# EAGLE design improved sample-and-hold-backup (EAGLE 7.2.0)
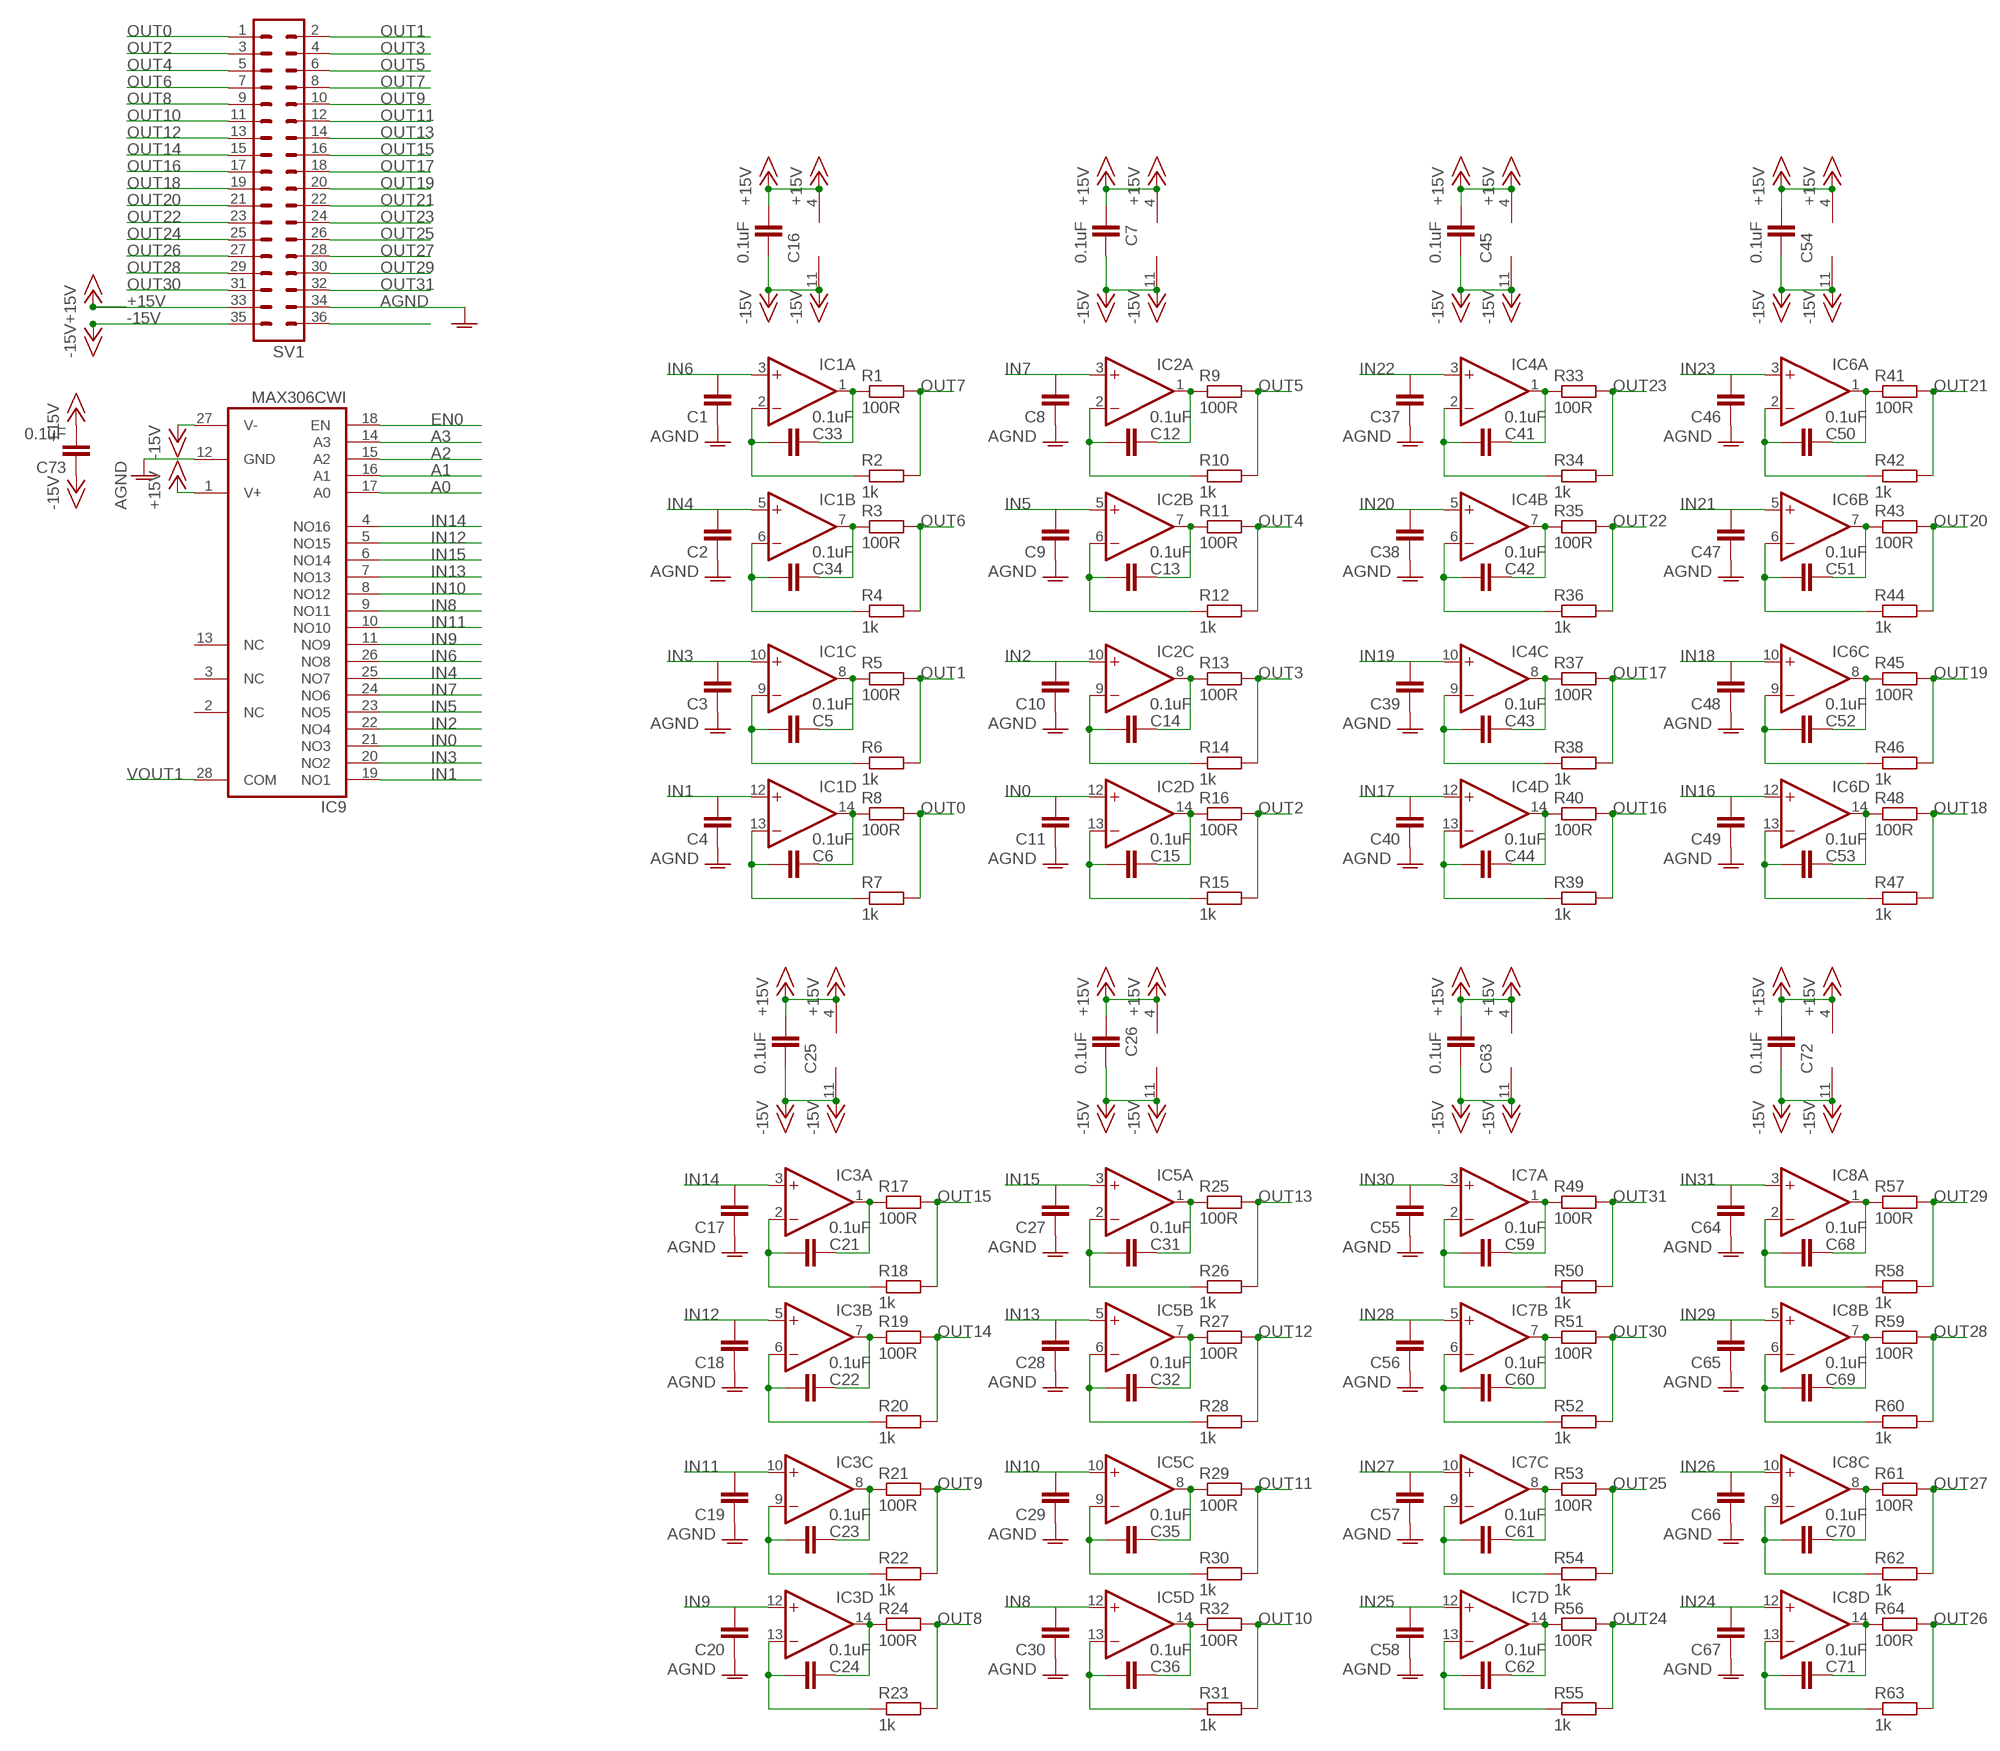
[diagram p0: schematic, sheet 1]

## Parts
C1  C-EUC1206  [C1206]
C2  C-EUC1206  [C1206]
C3  C-EUC1206  [C1206]
C4  C-EUC1206  [C1206]
C5  0.1uF  C-EUC0603  [C0603]
C6  0.1uF  C-EUC0603  [C0603]
C7  0.1uF  C-EUC0603  [C0603]
C8  C-EUC1206  [C1206]
C9  C-EUC1206  [C1206]
C10  C-EUC1206  [C1206]
C11  C-EUC1206  [C1206]
C12  0.1uF  C-EUC0603  [C0603]
C13  0.1uF  C-EUC0603  [C0603]
C14  0.1uF  C-EUC0603  [C0603]
C15  0.1uF  C-EUC0603  [C0603]
C16  0.1uF  C-EUC0603  [C0603]
C17  C-EUC1206  [C1206]
C18  C-EUC1206  [C1206]
C19  C-EUC1206  [C1206]
C20  C-EUC1206  [C1206]
C21  0.1uF  C-EUC0603  [C0603]
C22  0.1uF  C-EUC0603  [C0603]
C23  0.1uF  C-EUC0603  [C0603]
C24  0.1uF  C-EUC0603  [C0603]
C25  0.1uF  C-EUC0603  [C0603]
C26  0.1uF  C-EUC0603  [C0603]
C27  C-EUC1206  [C1206]
C28  C-EUC1206  [C1206]
C29  C-EUC1206  [C1206]
C30  C-EUC1206  [C1206]
C31  0.1uF  C-EUC0603  [C0603]
C32  0.1uF  C-EUC0603  [C0603]
C33  0.1uF  C-EUC0603  [C0603]
C34  0.1uF  C-EUC0603  [C0603]
C35  0.1uF  C-EUC0603  [C0603]
C36  0.1uF  C-EUC0603  [C0603]
C37  C-EUC1206  [C1206]
C38  C-EUC1206  [C1206]
C39  C-EUC1206  [C1206]
C40  C-EUC1206  [C1206]
C41  0.1uF  C-EUC0603  [C0603]
C42  0.1uF  C-EUC0603  [C0603]
C43  0.1uF  C-EUC0603  [C0603]
C44  0.1uF  C-EUC0603  [C0603]
C45  0.1uF  C-EUC0603  [C0603]
C46  C-EUC1206  [C1206]
C47  C-EUC1206  [C1206]
C48  C-EUC1206  [C1206]
C49  C-EUC1206  [C1206]
C50  0.1uF  C-EUC0603  [C0603]
C51  0.1uF  C-EUC0603  [C0603]
C52  0.1uF  C-EUC0603  [C0603]
C53  0.1uF  C-EUC0603  [C0603]
C54  0.1uF  C-EUC0603  [C0603]
C55  C-EUC1206  [C1206]
C56  C-EUC1206  [C1206]
C57  C-EUC1206  [C1206]
C58  C-EUC1206  [C1206]
C59  0.1uF  C-EUC0603  [C0603]
C60  0.1uF  C-EUC0603  [C0603]
C61  0.1uF  C-EUC0603  [C0603]
C62  0.1uF  C-EUC0603  [C0603]
C63  0.1uF  C-EUC0603  [C0603]
C64  C-EUC1206  [C1206]
C65  C-EUC1206  [C1206]
C66  C-EUC1206  [C1206]
C67  C-EUC1206  [C1206]
C68  0.1uF  C-EUC0603  [C0603]
C69  0.1uF  C-EUC0603  [C0603]
C70  0.1uF  C-EUC0603  [C0603]
C71  0.1uF  C-EUC0603  [C0603]
C72  0.1uF  C-EUC0603  [C0603]
C73  0.1uF  C-EUC0603  [C0603]
IC1  TL074D  [SO14]
IC2  TL074D  [SO14]
IC3  TL074D  [SO14]
IC4  TL074D  [SO14]
IC5  TL074D  [SO14]
IC6  TL074D  [SO14]
IC7  TL074D  [SO14]
IC8  TL074D  [SO14]
IC9  MAX306CWI  [SO28L]
R1  100R  R-EU_R0603  [R0603]
R2  1k  R-EU_R0603  [R0603]
R3  100R  R-EU_R0603  [R0603]
R4  1k  R-EU_R0603  [R0603]
R5  100R  R-EU_R0603  [R0603]
R6  1k  R-EU_R0603  [R0603]
R7  1k  R-EU_R0603  [R0603]
R8  100R  R-EU_R0603  [R0603]
R9  100R  R-EU_R0603  [R0603]
R10  1k  R-EU_R0603  [R0603]
R11  100R  R-EU_R0603  [R0603]
R12  1k  R-EU_R0603  [R0603]
R13  100R  R-EU_R0603  [R0603]
R14  1k  R-EU_R0603  [R0603]
R15  1k  R-EU_R0603  [R0603]
R16  100R  R-EU_R0603  [R0603]
R17  100R  R-EU_R0603  [R0603]
R18  1k  R-EU_R0603  [R0603]
R19  100R  R-EU_R0603  [R0603]
R20  1k  R-EU_R0603  [R0603]
R21  100R  R-EU_R0603  [R0603]
R22  1k  R-EU_R0603  [R0603]
R23  1k  R-EU_R0603  [R0603]
R24  100R  R-EU_R0603  [R0603]
R25  100R  R-EU_R0603  [R0603]
R26  1k  R-EU_R0603  [R0603]
R27  100R  R-EU_R0603  [R0603]
R28  1k  R-EU_R0603  [R0603]
R29  100R  R-EU_R0603  [R0603]
R30  1k  R-EU_R0603  [R0603]
R31  1k  R-EU_R0603  [R0603]
R32  100R  R-EU_R0603  [R0603]
R33  100R  R-EU_R0603  [R0603]
R34  1k  R-EU_R0603  [R0603]
R35  100R  R-EU_R0603  [R0603]
R36  1k  R-EU_R0603  [R0603]
R37  100R  R-EU_R0603  [R0603]
R38  1k  R-EU_R0603  [R0603]
R39  1k  R-EU_R0603  [R0603]
R40  100R  R-EU_R0603  [R0603]
R41  100R  R-EU_R0603  [R0603]
R42  1k  R-EU_R0603  [R0603]
R43  100R  R-EU_R0603  [R0603]
R44  1k  R-EU_R0603  [R0603]
R45  100R  R-EU_R0603  [R0603]
R46  1k  R-EU_R0603  [R0603]
R47  1k  R-EU_R0603  [R0603]
R48  100R  R-EU_R0603  [R0603]
R49  100R  R-EU_R0603  [R0603]
R50  1k  R-EU_R0603  [R0603]
R51  100R  R-EU_R0603  [R0603]
R52  1k  R-EU_R0603  [R0603]
R53  100R  R-EU_R0603  [R0603]
R54  1k  R-EU_R0603  [R0603]
R55  1k  R-EU_R0603  [R0603]
R56  100R  R-EU_R0603  [R0603]
R57  100R  R-EU_R0603  [R0603]
R58  1k  R-EU_R0603  [R0603]
R59  100R  R-EU_R0603  [R0603]
R60  1k  R-EU_R0603  [R0603]
R61  100R  R-EU_R0603  [R0603]
R62  1k  R-EU_R0603  [R0603]
R63  1k  R-EU_R0603  [R0603]
R64  100R  R-EU_R0603  [R0603]
SV1  MA18-2  [MA18-2]

## Nets
+15V: C7.1 C16.1 C25.1 C26.1 C45.1 C54.1 C63.1 C72.1 C73.2 IC1.4(P:V+) IC2.4(P:V+) IC3.4(P:V+) IC4.4(P:V+) IC5.4(P:V+) IC6.4(P:V+) IC7.4(P:V+) IC8.4(P:V+) IC9.1(V+) SV1.33
-15V: C7.2 C16.2 C25.2 C26.2 C45.2 C54.2 C63.2 C72.2 C73.1 IC1.11(P:V-) IC2.11(P:V-) IC3.11(P:V-) IC4.11(P:V-) IC5.11(P:V-) IC6.11(P:V-) IC7.11(P:V-) IC8.11(P:V-) IC9.27(V-) SV1.35
A0: IC9.17(A0)
A1: IC9.16(A1)
A2: IC9.15(A2)
A3: IC9.14(A3)
AGND: C1.1 C2.1 C3.1 C4.1 C8.1 C9.1 C10.1 C11.1 C17.1 C18.1 C19.1 C20.1 C27.1 C28.1 C29.1 C30.1 C37.1 C38.1 C39.1 C40.1 C46.1 C47.1 C48.1 C49.1 C55.1 C56.1 C57.1 C58.1 C64.1 C65.1 C66.1 C67.1 IC9.12(GND) SV1.34
EN0: IC9.18(EN)
IN0: C11.2 IC2.12(D:+IN) IC9.21(NO3)
IN1: C4.2 IC1.12(D:+IN) IC9.19(NO1)
IN2: C10.2 IC2.10(C:+IN) IC9.22(NO4)
IN3: C3.2 IC1.10(C:+IN) IC9.20(NO2)
IN4: C2.2 IC1.5(B:+IN) IC9.25(NO7)
IN5: C9.2 IC2.5(B:+IN) IC9.23(NO5)
IN6: C1.2 IC1.3(A:+IN) IC9.26(NO8)
IN7: C8.2 IC2.3(A:+IN) IC9.24(NO6)
IN8: C30.2 IC5.12(D:+IN) IC9.9(NO11)
IN9: C20.2 IC3.12(D:+IN) IC9.11(NO9)
IN10: C29.2 IC5.10(C:+IN) IC9.8(NO12)
IN11: C19.2 IC3.10(C:+IN) IC9.10(NO10)
IN12: C18.2 IC3.5(B:+IN) IC9.5(NO15)
IN13: C28.2 IC5.5(B:+IN) IC9.7(NO13)
IN14: C17.2 IC3.3(A:+IN) IC9.4(NO16)
IN15: C27.2 IC5.3(A:+IN) IC9.6(NO14)
IN16: C49.2 IC6.12(D:+IN)
IN17: C40.2 IC4.12(D:+IN)
IN18: C48.2 IC6.10(C:+IN)
IN19: C39.2 IC4.10(C:+IN)
IN20: C38.2 IC4.5(B:+IN)
IN21: C47.2 IC6.5(B:+IN)
IN22: C37.2 IC4.3(A:+IN)
IN23: C46.2 IC6.3(A:+IN)
IN24: C67.2 IC8.12(D:+IN)
IN25: C58.2 IC7.12(D:+IN)
IN26: C66.2 IC8.10(C:+IN)
IN27: C57.2 IC7.10(C:+IN)
IN28: C56.2 IC7.5(B:+IN)
IN29: C65.2 IC8.5(B:+IN)
IN30: C55.2 IC7.3(A:+IN)
IN31: C64.2 IC8.3(A:+IN)
N$1: C33.2 IC1.2(A:-IN) R2.1
N$2: C33.1 IC1.1(A:OUT) R1.1
N$3: C34.1 IC1.7(B:OUT) R3.1
N$4: C5.1 IC1.8(C:OUT) R5.1
N$5: C34.2 IC1.6(B:-IN) R4.1
N$6: C6.1 IC1.14(D:OUT) R8.1
N$7: C5.2 IC1.9(C:-IN) R6.1
N$8: C6.2 IC1.13(D:-IN) R7.1
N$9: C21.1 IC3.1(A:OUT) R17.1
N$10: C21.2 IC3.2(A:-IN) R18.1
N$11: C12.1 IC2.1(A:OUT) R9.1
N$12: C12.2 IC2.2(A:-IN) R10.1
N$13: C13.1 IC2.7(B:OUT) R11.1
N$14: C13.2 IC2.6(B:-IN) R12.1
N$15: C14.1 IC2.8(C:OUT) R13.1
N$16: C15.1 IC2.14(D:OUT) R16.1
N$17: C14.2 IC2.9(C:-IN) R14.1
N$18: C15.2 IC2.13(D:-IN) R15.1
N$19: C22.1 IC3.7(B:OUT) R19.1
N$20: C22.2 IC3.6(B:-IN) R20.1
N$21: C23.1 IC3.8(C:OUT) R21.1
N$22: C24.1 IC3.14(D:OUT) R24.1
N$23: C23.2 IC3.9(C:-IN) R22.1
N$24: C24.2 IC3.13(D:-IN) R23.1
N$25: C31.1 IC5.1(A:OUT) R25.1
N$26: C31.2 IC5.2(A:-IN) R26.1
N$27: C32.1 IC5.7(B:OUT) R27.1
N$28: C32.2 IC5.6(B:-IN) R28.1
N$29: C35.1 IC5.8(C:OUT) R29.1
N$30: C36.1 IC5.14(D:OUT) R32.1
N$31: C35.2 IC5.9(C:-IN) R30.1
N$32: C36.2 IC5.13(D:-IN) R31.1
N$33: C41.1 IC4.1(A:OUT) R33.1
N$34: C41.2 IC4.2(A:-IN) R34.1
N$35: C42.1 IC4.7(B:OUT) R35.1
N$36: C42.2 IC4.6(B:-IN) R36.1
N$37: C43.1 IC4.8(C:OUT) R37.1
N$38: C44.1 IC4.14(D:OUT) R40.1
N$39: C43.2 IC4.9(C:-IN) R38.1
N$40: C44.2 IC4.13(D:-IN) R39.1
N$41: C50.1 IC6.1(A:OUT) R41.1
N$42: C50.2 IC6.2(A:-IN) R42.1
N$43: C51.1 IC6.7(B:OUT) R43.1
N$44: C51.2 IC6.6(B:-IN) R44.1
N$45: C52.1 IC6.8(C:OUT) R45.1
N$46: C53.1 IC6.14(D:OUT) R48.1
N$47: C52.2 IC6.9(C:-IN) R46.1
N$48: C53.2 IC6.13(D:-IN) R47.1
N$49: C59.1 IC7.1(A:OUT) R49.1
N$50: C59.2 IC7.2(A:-IN) R50.1
N$51: C60.1 IC7.7(B:OUT) R51.1
N$52: C60.2 IC7.6(B:-IN) R52.1
N$53: C61.1 IC7.8(C:OUT) R53.1
N$54: C62.1 IC7.14(D:OUT) R56.1
N$55: C61.2 IC7.9(C:-IN) R54.1
N$56: C62.2 IC7.13(D:-IN) R55.1
N$57: C68.1 IC8.1(A:OUT) R57.1
N$58: C68.2 IC8.2(A:-IN) R58.1
N$59: C69.1 IC8.7(B:OUT) R59.1
N$60: C69.2 IC8.6(B:-IN) R60.1
N$61: C70.1 IC8.8(C:OUT) R61.1
N$62: C71.1 IC8.14(D:OUT) R64.1
N$63: C70.2 IC8.9(C:-IN) R62.1
N$64: C71.2 IC8.13(D:-IN) R63.1
N$65: SV1.36
OUT0: R7.2 R8.2 SV1.1
OUT1: R5.2 R6.2 SV1.2
OUT2: R15.2 R16.2 SV1.3
OUT3: R13.2 R14.2 SV1.4
OUT4: R11.2 R12.2 SV1.5
OUT5: R9.2 R10.2 SV1.6
OUT6: R3.2 R4.2 SV1.7
OUT7: R1.2 R2.2 SV1.8
OUT8: R23.2 R24.2 SV1.9
OUT9: R21.2 R22.2 SV1.10
OUT10: R31.2 R32.2 SV1.11
OUT11: R29.2 R30.2 SV1.12
OUT12: R27.2 R28.2 SV1.13
OUT13: R25.2 R26.2 SV1.14
OUT14: R19.2 R20.2 SV1.15
OUT15: R17.2 R18.2 SV1.16
OUT16: R39.2 R40.2 SV1.17
OUT17: R37.2 R38.2 SV1.18
OUT18: R47.2 R48.2 SV1.19
OUT19: R45.2 R46.2 SV1.20
OUT20: R43.2 R44.2 SV1.21
OUT21: R41.2 R42.2 SV1.22
OUT22: R35.2 R36.2 SV1.23
OUT23: R33.2 R34.2 SV1.24
OUT24: R55.2 R56.2 SV1.25
OUT25: R53.2 R54.2 SV1.26
OUT26: R63.2 R64.2 SV1.27
OUT27: R61.2 R62.2 SV1.28
OUT28: R59.2 R60.2 SV1.29
OUT29: R57.2 R58.2 SV1.30
OUT30: R51.2 R52.2 SV1.31
OUT31: R49.2 R50.2 SV1.32
VOUT1: IC9.28(COM)
Unconnected: IC9.2(NC) IC9.3(NC) IC9.13(NC)

## Library data of the parts
C1-C73 = resistor:C-EU: CAPACITOR, European symbol
IC1-IC8 = linear:TL074: OP AMP
IC9 = maxim:MAX306CWI: MULTIPLEXER; MF: MAXIM; MPN: MAX306CWI; OC_FARNELL: unknown; OC_NEWARK: 90C2555
R1-R64 = resistor:R-EU_: RESISTOR, European symbol
SV1 = con-lstb:MA18-2: PIN HEADER; OC_FARNELL: unknown; OC_NEWARK: unknown

## Board
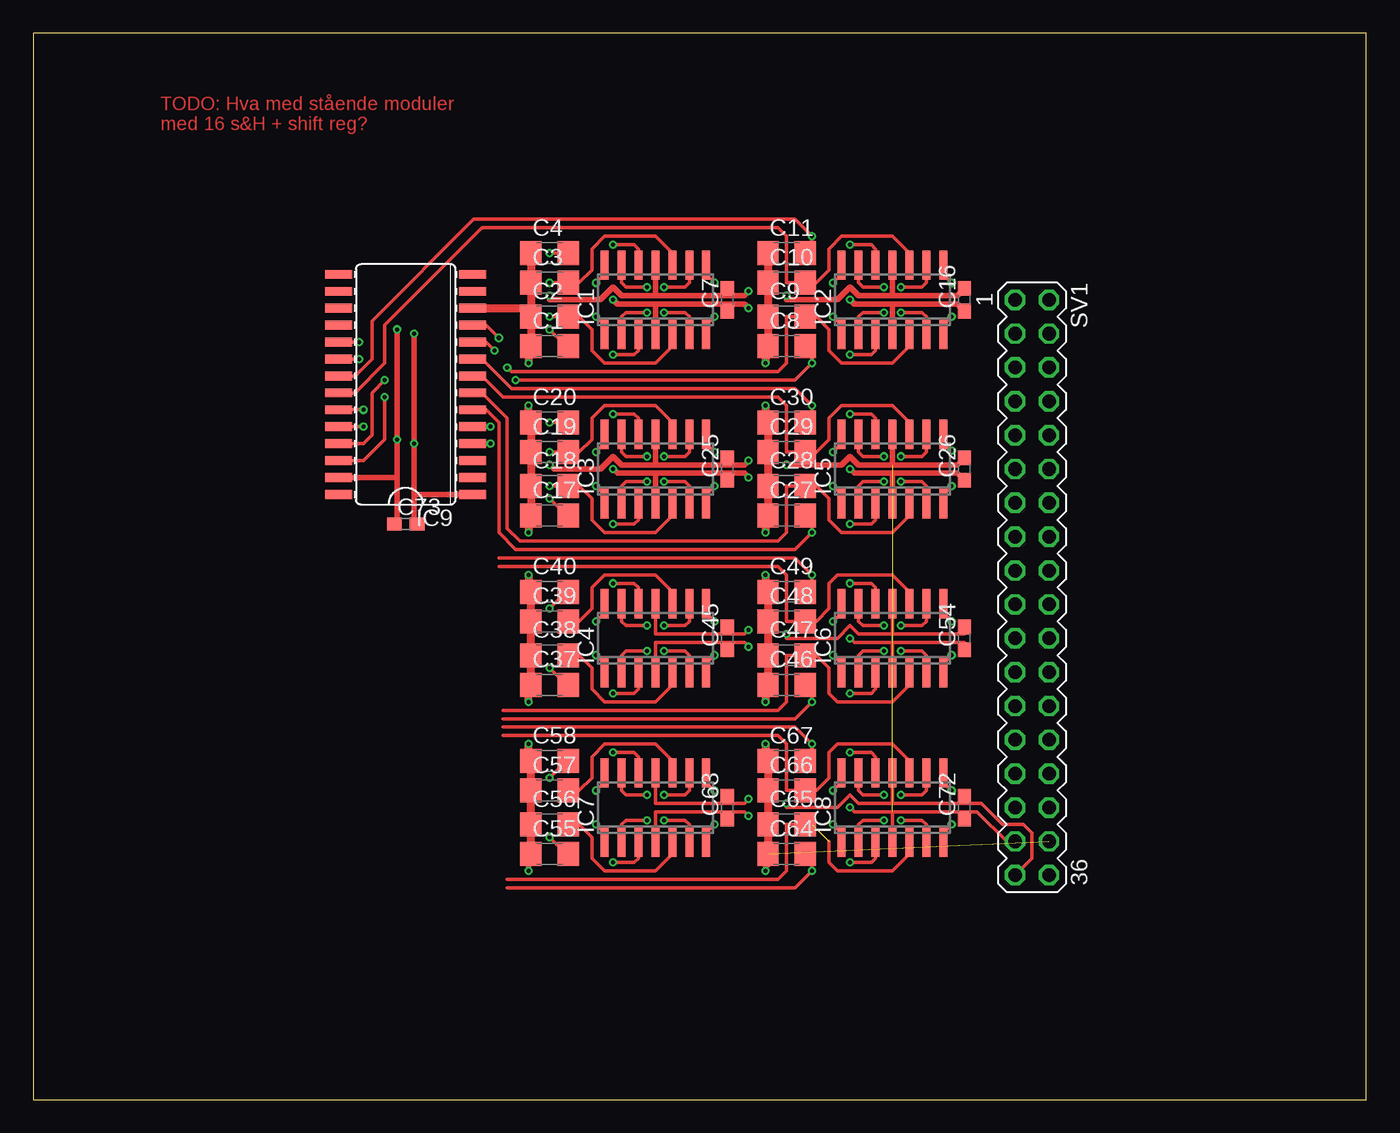
[diagram p1: board, top side]
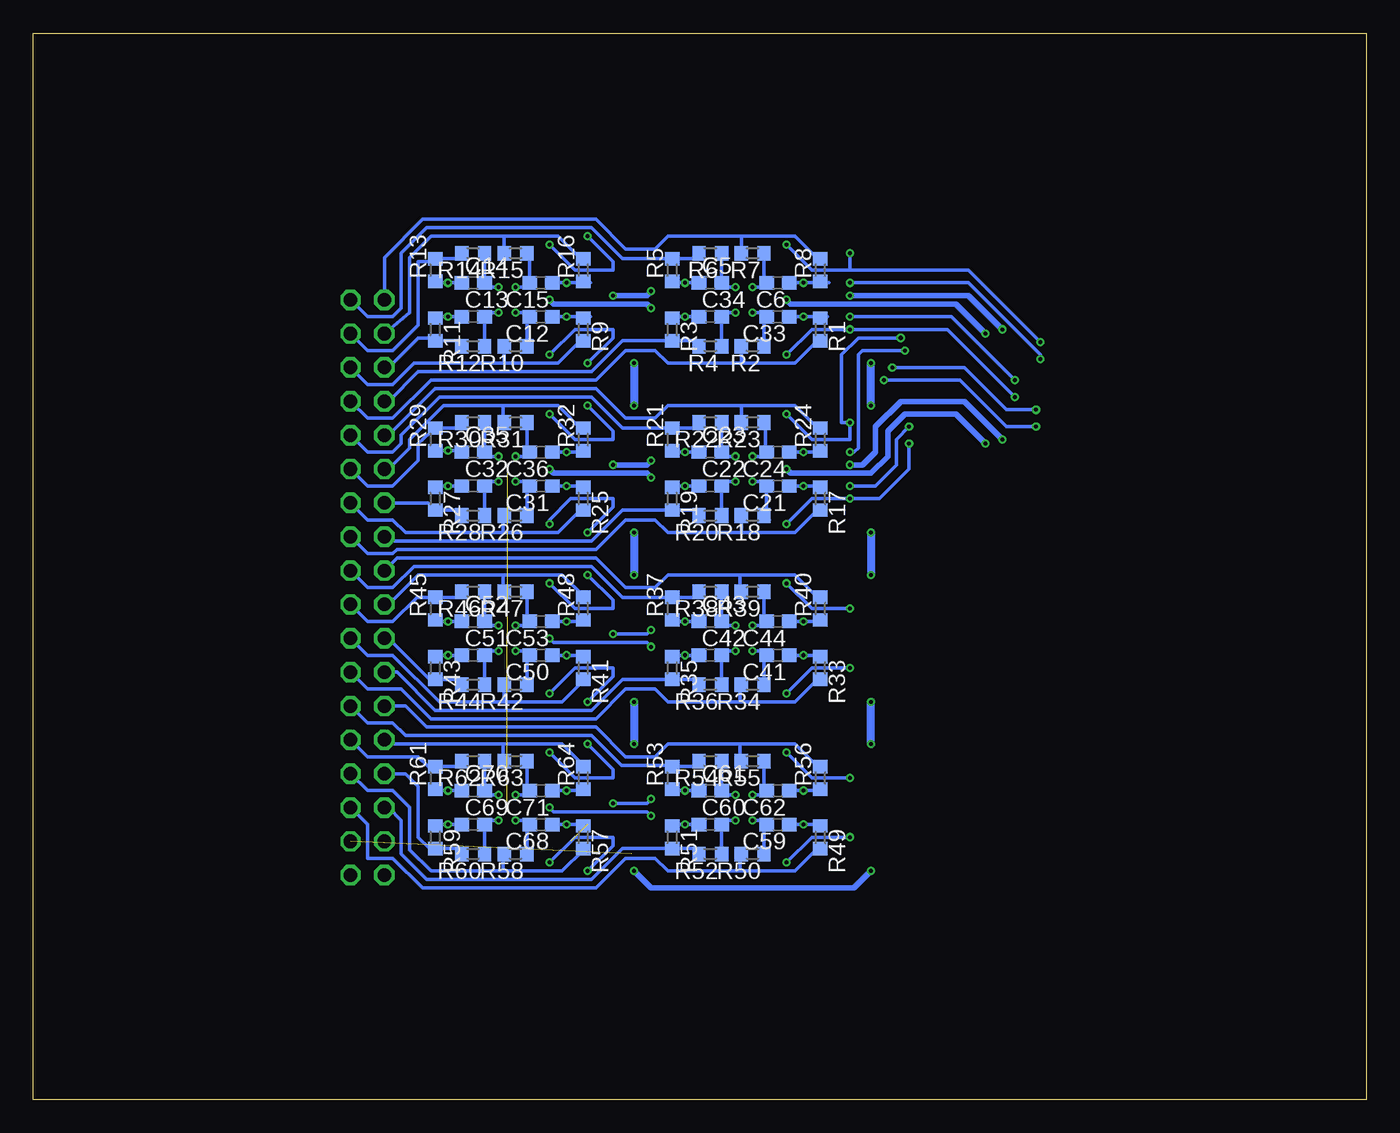
[diagram p2: board, bottom side, seen from below]

Size 100 x 80 mm. Coordinates in mm from the lower left corner, seen from the top.
Outline: 0,0 100,0 100,80 0,80 0,0
Copper layers (1*16): Top 0.035mm / dielectric 1.5mm / Bottom 0.035mm
Design rules "dirt_cheap_dirty_boards.v1": minimum track width 5mil, minimum drill 12mil, track to track 5mil, track to pad 5mil, pad to pad 5mil, via to via 5mil, smd to smd 0mil, copper to edge 10mil, drill to drill 10mil, minimum pad ring 10mil, minimum via ring 6mil, stop-mask expansion 2mil, vias tented up to drill 25mil, thermal gap 10mil

### Footprints (pad centres in the part's own frame; a part is rotated, then mirrored left to right if it is on the bottom)
C1206 = smd 1.6 x 1.8: 1 -1.4,0; 2 1.4,0
C0603 = smd 1.1 x 1: 1 -0.85,0; 2 0.85,0
SO14 = smd 0.6 x 2.2: 1 -3.81,-2.6; 2 -2.54,-2.6; 3 -1.27,-2.6; 4 0,-2.6; 5 1.27,-2.6; 6 2.54,-2.6; 7 3.81,-2.6; 8 3.81,2.6; 9 2.54,2.6; 10 1.27,2.6; 11 0,2.6; 12 -1.27,2.6; 13 -2.54,2.6; 14 -3.81,2.6
SO28L = smd 0.66 x 2.032: 1 -8.255,-5.029; 2 -6.985,-5.029; 3 -5.715,-5.029; 4 -4.445,-5.029; 5 -3.175,-5.029; 6 -1.905,-5.029; 7 -0.635,-5.029; 8 0.635,-5.029; 9 1.905,-5.029; 10 3.175,-5.029; 11 4.445,-5.029; 12 5.715,-5.029; 13 6.985,-5.029; 14 8.255,-5.029; 15 8.255,5.029; 16 6.985,5.029; 17 5.715,5.029; 18 4.445,5.029; 19 3.175,5.029; 20 1.905,5.029; 21 0.635,5.029; 22 -0.635,5.029; 23 -1.905,5.029; 24 -3.175,5.029; 25 -4.445,5.029; 26 -5.715,5.029; 27 -6.985,5.029; 28 -8.255,5.029
R0603 = smd 1 x 1.1: 1 -0.85,0; 2 0.85,0
MA18-2 = drill 1.016 octagon: 1 -21.59,-1.27; 2 -21.59,1.27; 3 -19.05,-1.27; 4 -19.05,1.27; 5 -16.51,-1.27; 6 -16.51,1.27; 7 -13.97,-1.27; 8 -13.97,1.27; 9 -11.43,-1.27; 10 -11.43,1.27; 11 -8.89,-1.27; 12 -8.89,1.27; 13 -6.35,-1.27; 14 -6.35,1.27; 15 -3.81,-1.27; 16 -3.81,1.27; 17 -1.27,-1.27; 18 -1.27,1.27; 19 1.27,-1.27; 20 1.27,1.27; 21 3.81,-1.27; 22 3.81,1.27; 23 6.35,-1.27; 24 6.35,1.27; 25 8.89,-1.27; 26 8.89,1.27; 27 11.43,-1.27; 28 11.43,1.27; 29 13.97,-1.27; 30 13.97,1.27; 31 16.51,-1.27; 32 16.51,1.27; 33 19.05,-1.27; 34 19.05,1.27; 35 21.59,-1.27; 36 21.59,1.27

### Placement (x,y rotation side)
C1  38.73,56.52 0 top
C2  38.73,58.74 0 top
C3  38.73,61.28 0 top
C4  38.73,63.5 0 top
C5  49.21,61.28 0 bottom
C6  44.13,61.28 180 bottom
C7  52.07,60.01 90 top
C8  56.52,56.52 0 top
C9  56.52,58.74 0 top
C10  56.52,61.28 0 top
C11  56.52,63.5 0 top
C12  61.91,58.74 180 bottom
C13  66.99,58.74 0 bottom
C14  66.99,61.28 0 bottom
C15  61.91,61.28 180 bottom
C16  69.85,60.01 90 top
C17  38.73,43.81 0 top
C18  38.73,46.04 0 top
C19  38.73,48.58 0 top
C20  38.73,50.8 0 top
C21  44.13,46.04 180 bottom
C22  49.21,46.04 0 bottom
C23  49.21,48.58 0 bottom
C24  44.13,48.58 180 bottom
C25  52.07,47.31 90 top
C26  69.85,47.31 90 top
C27  56.52,43.81 0 top
C28  56.52,46.04 0 top
C29  56.52,48.58 0 top
C30  56.52,50.8 0 top
C31  61.91,46.04 180 bottom
C32  66.99,46.04 0 bottom
C33  44.13,58.74 180 bottom
C34  49.21,58.74 0 bottom
C35  66.99,48.58 0 bottom
C36  61.91,48.58 180 bottom
C37  38.73,31.11 0 top
C38  38.73,33.34 0 top
C39  38.73,35.88 0 top
C40  38.73,38.1 0 top
C41  44.13,33.34 180 bottom
C42  49.21,33.34 0 bottom
C43  49.21,35.88 0 bottom
C44  44.13,35.88 180 bottom
C45  52.07,34.61 90 top
C46  56.52,31.11 0 top
C47  56.52,33.34 0 top
C48  56.52,35.88 0 top
C49  56.52,38.1 0 top
C50  61.91,33.34 180 bottom
C51  66.99,33.34 0 bottom
C52  66.99,35.88 0 bottom
C53  61.91,35.88 180 bottom
C54  69.85,34.61 90 top
C55  38.73,18.41 0 top
C56  38.73,20.64 0 top
C57  38.73,23.18 0 top
C58  38.73,25.4 0 top
C59  44.13,20.64 180 bottom
C60  49.21,20.64 0 bottom
C61  49.21,23.18 0 bottom
C62  44.13,23.18 180 bottom
C63  52.07,21.91 90 top
C64  56.52,18.41 0 top
C65  56.52,20.64 0 top
C66  56.52,23.18 0 top
C67  56.52,25.4 0 top
C68  61.91,20.64 180 bottom
C69  66.99,20.64 0 bottom
C70  66.99,23.18 0 bottom
C71  61.91,23.18 180 bottom
C72  69.85,21.91 90 top
C73  27.94,43.18 0 top
IC1  46.67,60.01 0 top
IC2  64.45,60.01 0 top
IC3  46.67,47.31 0 top
IC4  46.67,34.61 0 top
IC5  64.45,47.31 0 top
IC6  64.45,34.61 0 top
IC7  46.67,21.91 0 top
IC8  64.45,21.91 0 top
IC9  27.94,53.66 90 top
R1  40.96,57.78 270 bottom
R2  46.04,56.52 180 bottom
R3  52.07,57.78 270 bottom
R4  49.21,56.52 180 bottom
R5  52.07,62.23 90 bottom
R6  49.21,63.5 180 bottom
R7  46.04,63.5 180 bottom
R8  40.96,62.23 90 bottom
R9  58.74,57.78 270 bottom
R10  63.82,56.52 180 bottom
R11  69.85,57.78 270 bottom
R12  66.99,56.52 180 bottom
R13  69.85,62.23 90 bottom
R14  66.99,63.5 180 bottom
R15  63.82,63.5 180 bottom
R16  58.74,62.23 90 bottom
R17  40.96,45.09 270 bottom
R18  46.04,43.81 180 bottom
R19  52.07,45.09 270 bottom
R20  49.21,43.81 180 bottom
R21  52.07,49.53 90 bottom
R22  49.21,50.8 180 bottom
R23  46.04,50.8 180 bottom
R24  40.96,49.53 90 bottom
R25  58.74,45.09 270 bottom
R26  63.82,43.81 180 bottom
R27  69.85,45.09 270 bottom
R28  66.99,43.81 180 bottom
R29  69.85,49.53 90 bottom
R30  66.99,50.8 180 bottom
R31  63.82,50.8 180 bottom
R32  58.74,49.53 90 bottom
R33  40.96,32.38 270 bottom
R34  46.04,31.11 180 bottom
R35  52.07,32.38 270 bottom
R36  49.21,31.11 180 bottom
R37  52.07,36.83 90 bottom
R38  49.21,38.1 180 bottom
R39  46.04,38.1 180 bottom
R40  40.96,36.83 90 bottom
R41  58.74,32.38 270 bottom
R42  63.82,31.11 180 bottom
R43  69.85,32.38 270 bottom
R44  66.99,31.11 180 bottom
R45  69.85,36.83 90 bottom
R46  66.99,38.1 180 bottom
R47  63.82,38.1 180 bottom
R48  58.74,36.83 90 bottom
R49  40.96,19.68 270 bottom
R50  46.04,18.41 180 bottom
R51  52.07,19.68 270 bottom
R52  49.21,18.41 180 bottom
R53  52.07,24.13 90 bottom
R54  49.21,25.4 180 bottom
R55  46.04,25.4 180 bottom
R56  40.96,24.13 90 bottom
R57  58.74,19.68 270 bottom
R58  63.82,18.41 180 bottom
R59  69.85,19.68 270 bottom
R60  66.99,18.41 180 bottom
R61  69.85,24.13 90 bottom
R62  66.99,25.4 180 bottom
R63  63.82,25.4 180 bottom
R64  58.74,24.13 90 bottom
SV1  74.93,38.42 270 top

### Tracks (layer width: path | path; a pad name or v marks a point on that pad's centre or on a via)
+15V  (via drill 0.3)  (2 unrouted)
  Top 0.254: IC4.4 46.67,34.29 52.07,34.29 | 52.07,34.29 C45.1 | C54.1 69.85,34.29 64.45,34.29 | 64.45,34.29 61.59,34.29 v61.28,34.61 | v53.66,33.97 53.34,34.29 52.07,34.29 | IC6.4 64.45,34.29 | IC7.4 46.67,21.59 52.07,21.59 | 52.07,21.59 C63.1 | 69.85,21.59 64.45,21.59 | 64.45,21.59 61.59,21.59 v61.28,21.91 | v53.66,21.27 53.34,21.59 52.07,21.59 | IC8.4 64.45,21.59 | C72.1 69.85,21.59 | 69.85,21.59 70.8,21.59 73.03,19.37 SV1.33
  Top 0.406: 28.57,45.4 v28.57,49.21 v28.57,57.47 | 28.57,45.4 28.57,43.4 C73.2 | IC9.1 28.57,45.4 | IC3.4 46.67,46.99 | v43.5,47.31 43.81,46.99 46.67,46.99 | 46.67,46.99 52.07,46.99 | v53.66,59.37 53.34,59.69 52.07,59.69 | C7.1 52.07,59.69 | 52.07,59.69 46.67,59.69 | 46.67,59.69 43.81,59.69 v43.5,60.01 | IC1.4 46.67,59.69 | v61.28,60.01 61.59,59.69 64.45,59.69 | 64.45,59.69 69.32,59.69 C16.1 | IC2.4 64.45,59.69 | C25.1 52.07,46.99 | 52.07,46.99 53.34,46.99 v53.66,46.67 | v61.28,47.31 61.59,46.99 64.45,46.99 | 64.45,46.99 69.32,46.99 C26.1 | 64.45,46.99 IC5.4
  Bottom 0.254: v61.28,34.61 60.96,34.29 53.98,34.29 v53.66,33.97 | v61.28,21.91 60.96,21.59 53.98,21.59 v53.66,21.27
  Bottom 0.406: v43.5,47.31 43.18,46.99 37.15,46.99 35.88,48.26 35.88,50.16 34.61,51.44 30.8,51.44 v28.57,49.21 | v43.5,60.01 43.18,59.69 30.8,59.69 v28.57,57.47 | v53.66,59.37 53.98,59.69 60.96,59.69 v61.28,60.01 | v53.66,46.67 53.98,46.99 60.96,46.99 v61.28,47.31
-15V  (via drill 0.3)  (2 unrouted)
  Top 0.254: C25.2 52.07,47.62 52.39,47.62 | IC4.11 46.67,34.92 52.07,34.92 | 52.07,34.92 C45.2 | C54.2 69.85,34.92 64.45,34.92 | IC6.11 64.45,34.92 | 64.45,34.92 61.91,34.92 61.28,35.56 60.33,34.61 56.52,34.61 v56.52,34.92 | v53.66,35.24 53.34,34.92 52.07,34.92 | IC7.11 46.67,22.23 52.07,22.23 | 52.07,22.23 C63.2 | C72.2 69.85,22.23 | 69.85,22.23 64.45,22.23 | 64.45,22.23 61.91,22.23 61.28,22.86 60.33,21.91 56.52,21.91 v56.52,22.23 | v53.66,22.54 53.34,22.23 52.07,22.23 | IC8.11 64.45,22.23 | 69.85,22.23 71.12,22.23 72.71,20.64 74.3,20.64 74.93,20 74.93,18.1 SV1.35
  Top 0.406: 26.99,43.18 27.3,43.18 27.3,46.67 | 27.3,46.67 IC9.27 | 27.3,46.67 v27.3,49.53 v27.3,57.78 | v38.73,47.62 39.05,47.31 42.55,47.31 43.5,48.26 44.13,47.62 46.67,47.62 | 46.67,47.62 52.39,47.62 53.34,47.62 v53.66,47.94 | IC3.11 46.67,47.62 | v53.66,60.64 53.34,60.33 52.07,60.33 | C7.2 52.07,60.33 | 52.07,60.33 46.67,60.33 | 46.67,60.33 44.13,60.33 43.5,60.96 42.55,60.01 38.73,60.01 v38.73,60.33 | IC1.11 46.67,60.33 | v56.52,60.33 56.52,60.01 60.33,60.01 61.28,60.96 61.91,60.33 64.45,60.33 | 64.45,60.33 69.32,60.33 C16.2 | IC2.11 64.45,60.33 | v56.52,47.62 60.64,47.62 61.28,48.26 61.91,47.62 64.45,47.62 | 64.45,47.62 69.32,47.62 C26.2 | IC5.11 64.45,47.62
  Top 0.61: 26.99,43.18 C73.1
  Bottom 0.254: v56.52,34.92 53.98,34.92 v53.66,35.24 | v56.52,22.23 53.98,22.23 v53.66,22.54
  Bottom 0.406: v27.3,49.53 30.16,52.39 34.92,52.39 36.83,50.48 36.83,48.58 37.78,47.62 v38.73,47.62 | v38.73,60.33 29.84,60.33 v27.3,57.78 | v53.66,60.64 53.98,60.33 v56.52,60.33 | v53.66,47.94 53.98,47.62 v56.52,47.62
AGND  (via drill 0.3)  (1 unrouted)
  Top 0.254: 37.34,59.37 C2.1 | C10.1 55.24,61.28 | C27.1 55.24,43.69 | C20.1 37.34,51.44 37.15,51.44 | 37.15,56.52 C1.1
  Top 0.406: C64.1 55.12,17.65 54.93,17.46 v54.93,17.14 | v37.15,17.14 37.15,18.23 C55.1
  Top 0.61: IC9.12 37.34,59.37 | C4.1 C3.1 C2.1 C1.1 | C20.1 C19.1 C18.1 C17.1 37.34,43.69 37.15,43.5 v37.15,42.55 | 37.15,56.52 v37.15,55.24 | 37.15,51.44 v37.15,52.07 | v37.15,39.37 37.15,38.29 C40.1 C39.1 C38.1 C37.1 37.15,30.93 v37.15,29.84 | C55.1 C56.1 C57.1 C58.1 37.34,25.53 37.15,25.72 v37.15,26.67 | C11.1 C10.1 C9.1 C8.1 55.12,56.07 54.93,55.88 v54.93,55.24 | v54.93,52.07 54.93,50.99 C30.1 C29.1 C28.1 C27.1 | 55.24,43.69 55.24,43.5 54.93,43.18 v54.93,42.55 | v54.93,39.37 54.93,38.29 C49.1 C48.1 C47.1 C46.1 55.12,30.98 54.93,30.8 v54.93,29.84 | v54.93,26.67 54.93,25.59 C67.1 C66.1 C65.1 C64.1
  Bottom 0.406: v54.93,17.14 53.66,15.88 38.42,15.88 v37.15,17.14
  Bottom 0.61: v37.15,52.07 v37.15,55.24 | v37.15,42.55 v37.15,39.37 | v37.15,26.67 v37.15,29.84 | v54.93,42.55 v54.93,39.37 | v54.93,29.84 v54.93,26.67 | v54.93,55.24 v54.93,52.07
IN0  (via drill 0.3)
  Top 0.254: IC2.12 63.18,63.82 62.87,64.14 v61.28,64.14 | C11.2 58.42,63.5 v58.42,64.77 57.15,66.04 33.02,66.04 25.4,58.42 25.4,55.56 24.13,54.29 IC9.21
  Bottom 0.254: v61.28,64.14 59.37,62.23 56.52,62.23 56.52,62.87 v58.42,64.77
IN1  (via drill 0.3)
  Top 0.254: C4.2 v38.73,63.5 | IC1.12 45.4,63.82 45.09,64.14 v43.5,64.14 | IC9.19 v24.45,56.83
  Bottom 0.254: 38.73,62.23 29.84,62.23 v24.45,56.83 | v43.5,64.14 41.59,62.23 38.73,62.23 | 38.73,62.23 v38.73,63.5
IN2
  Top 0.254: IC2.10 65.72,63.5 64.45,64.77 60.64,64.77 59.69,63.82 59.69,62.23 58.74,61.28 C10.2 57.91,61.41 57.78,61.28 56.52,61.28 56.52,64.77 55.88,65.41 33.66,65.41 26.35,58.1 26.35,55.24 24.13,53.02 IC9.22
IN3  (via drill 0.3)
  Top 0.254: v38.73,61.28 C3.2 40.96,61.28 41.91,62.23 41.91,63.82 42.86,64.77 46.67,64.77 47.94,63.5 IC1.10 | IC9.20 v24.45,55.56
  Bottom 0.254: v38.73,61.28 29.84,61.28 24.45,55.88 v24.45,55.56
IN4  (via drill 0.3)
  Top 0.254: v38.73,58.74 C2.2 40.13,58.61 40.01,58.74 40.96,58.74 41.91,57.78 41.91,56.2 42.86,55.24 46.67,55.24 47.94,56.52 IC1.5 | v26.35,53.98 25.4,53.02 25.4,49.85 24.77,49.21 IC9.25
  Bottom 0.254: v38.73,58.74 31.11,58.74 v26.35,53.98
IN5  (via drill 0.3)
  Top 0.254: IC2.5 65.72,56.52 64.45,55.24 60.64,55.24 59.69,56.2 59.69,57.78 58.74,58.74 C9.2 57.91,58.61 57.78,58.74 56.52,58.74 56.52,55.24 55.88,54.61 35.88,54.61 v35.56,54.93 | v24.77,51.75 IC9.23
  Bottom 0.254: v35.56,54.93 30.16,54.93 26.99,51.75 v24.77,51.75
IN6  (via drill 0.3)
  Top 0.254: C1.2 40.01,56.52 v38.73,57.78 | v43.5,55.88 45.09,55.88 45.4,56.2 IC1.3 | v26.35,52.7 26.35,49.53 24.77,47.94 IC9.26
  Bottom 0.254: v43.5,55.88 41.59,57.78 v38.73,57.78 31.43,57.78 v26.35,52.7
IN7  (via drill 0.3)
  Top 0.254: IC2.3 63.18,56.2 62.87,55.88 v61.28,55.88 | C8.2 57.78,56.2 58.42,55.88 v58.42,55.24 57.15,53.98 v36.2,53.98 | v24.77,50.48 IC9.24
  Bottom 0.254: v61.28,55.88 59.37,57.78 56.52,57.78 56.52,57.15 v58.42,55.24 | v36.2,53.98 30.48,53.98 26.99,50.48 v24.77,50.48
IN8  (via drill 0.3)
  Top 0.254: IC5.12 63.18,51.12 62.87,51.44 v61.28,51.44 | 57.78,50.93 C30.2 58.1,50.8 58.42,51.12 v58.42,52.07 57.15,53.34 35.88,53.34 33.66,55.56 IC9.9
  Bottom 0.254: v61.28,51.44 59.37,49.53 56.52,49.53 56.52,50.16 v58.42,52.07
IN9  (via drill 0.3)
  Top 0.254: C20.2 v38.73,50.8 | v43.5,51.44 45.09,51.44 45.4,51.12 IC3.12 | IC9.11 33.97,58.1 v34.92,57.15
  Bottom 0.254: v43.5,51.44 41.59,49.53 38.73,49.53 v38.73,50.8 39.37,50.8 39.37,55.88 38.1,57.15 v34.92,57.15
IN10
  Top 0.254: IC5.10 65.72,50.8 64.45,52.07 60.64,52.07 59.69,51.12 59.69,49.53 58.74,48.58 C29.2 56.52,48.58 56.52,52.07 55.88,52.7 35.24,52.7 33.66,54.29 IC9.8
IN11  (via drill 0.3)
  Top 0.254: IC3.10 47.94,50.8 46.67,52.07 42.86,52.07 41.91,51.12 41.91,49.53 40.96,48.58 C19.2 v38.73,48.58 | IC9.10 33.97,56.83 v34.61,56.2
  Bottom 0.254: v34.61,56.2 37.78,56.2 38.1,55.88 38.1,48.9 38.42,48.58 v38.73,48.58
IN12  (via drill 0.3)
  Top 0.254: IC3.5 47.94,43.81 46.67,42.55 42.86,42.55 41.91,43.5 41.91,45.09 40.96,46.04 C18.2 v38.73,46.04 | IC9.5 v34.29,50.48
  Bottom 0.254: v34.29,50.48 35.24,49.53 35.24,47.62 36.83,46.04 v38.73,46.04
IN13
  Top 0.254: IC5.5 65.72,43.81 64.45,42.55 60.64,42.55 59.69,43.5 59.69,45.09 58.74,46.04 C28.2 56.52,46.04 56.52,42.55 55.88,41.91 36.51,41.91 35.56,42.86 35.56,51.12 33.66,53.02 IC9.7
IN14  (via drill 0.3)
  Top 0.254: C17.2 40.01,43.81 v38.73,45.09 | v43.5,43.18 45.09,43.18 45.4,43.5 IC3.3 | IC9.4 v34.29,49.21
  Bottom 0.254: v43.5,43.18 41.59,45.09 v38.73,45.09 38.42,45.09 36.51,45.09 34.29,47.31 v34.29,49.21
IN15  (via drill 0.3)
  Top 0.254: IC5.3 63.18,43.5 62.87,43.18 v61.28,43.18 | 57.78,43.69 C27.2 58.42,43.31 v58.42,42.55 57.15,41.27 36.2,41.27 34.92,42.55 34.92,50.8 33.97,51.75 IC9.6
  Bottom 0.254: v61.28,43.18 61.28,43.5 59.69,45.09 56.52,45.09 56.52,44.45 v58.42,42.55
IN16  (via drill 0.3)
  Top 0.254: IC6.12 63.18,38.42 62.87,38.73 v61.28,38.73 | 57.78,38.23 C49.2 57.91,38.23 58.42,38.73 v58.42,39.37 57.15,40.64 34.92,40.64
  Bottom 0.254: v61.28,38.73 59.37,36.83 56.52,36.83 56.52,37.47 v58.42,39.37
IN17  (via drill 0.3)
  Top 0.254: IC4.12 45.4,38.42 45.09,38.73 v43.5,38.73 | v38.73,36.83 39.37,37.47 39.5,37.47 C40.2
  Bottom 0.254: v43.5,38.73 41.59,36.83 v38.73,36.83
IN18
  Top 0.254: IC6.10 65.72,38.1 64.45,39.37 60.33,39.37 59.69,38.73 59.69,36.83 58.74,35.88 C48.2 56.52,35.88 56.52,39.37 55.88,40.01 34.92,40.01
IN19
  Top 0.254: C39.2 40.96,35.88 41.91,36.83 41.91,38.42 42.86,39.37 46.67,39.37 47.94,38.1 IC4.10
IN20
  Top 0.254: C38.2 40.96,33.34 41.91,32.38 41.91,30.8 42.86,29.84 46.67,29.84 47.94,31.11 IC4.5
IN21
  Top 0.254: IC6.5 65.72,31.11 64.45,29.84 60.33,29.84 59.69,30.48 59.69,32.38 58.74,33.34 C47.2 56.52,33.34 56.52,29.84 55.88,29.21 35.24,29.21
IN22  (via drill 0.3)
  Top 0.254: IC4.3 45.4,30.8 45.09,30.48 v43.5,30.48 | v38.73,32.38 39.37,31.75 39.5,31.75 C37.2
  Bottom 0.254: v43.5,30.48 41.59,32.38 v38.73,32.38
IN23  (via drill 0.3)
  Top 0.254: IC6.3 63.18,30.8 62.87,30.48 v61.28,30.48 | 57.78,30.98 C46.2 58.42,31.11 v58.42,29.84 57.15,28.57 35.24,28.57
  Bottom 0.254: v61.28,30.48 59.37,32.38 56.52,32.38 56.52,31.75 v58.42,29.84
IN24  (via drill 0.3)
  Top 0.254: IC8.12 63.18,25.72 62.87,26.04 v61.28,26.04 | 57.78,25.53 C67.2 58.42,25.4 v58.42,26.67 57.15,27.94 35.24,27.94
  Bottom 0.254: v61.28,26.04 59.37,24.13 56.52,24.13 56.52,24.77 v58.42,26.67
IN25  (via drill 0.3)
  Top 0.254: IC7.12 45.4,25.72 45.09,26.04 v43.5,26.04 | v38.73,24.13 39.37,24.77 39.5,24.77 C58.2
  Bottom 0.254: v43.5,26.04 41.59,24.13 v38.73,24.13
IN26
  Top 0.254: IC8.10 65.72,25.4 64.45,26.67 60.33,26.67 59.69,26.04 59.69,24.13 58.74,23.18 C66.2 56.52,23.18 56.52,26.67 55.88,27.3 35.24,27.3
IN27
  Top 0.254: C57.2 40.96,23.18 41.91,24.13 41.91,25.72 42.86,26.67 46.67,26.67 47.94,25.4 IC7.10
IN28
  Top 0.254: C56.2 40.96,20.64 41.91,19.68 41.91,18.1 42.86,17.14 46.67,17.14 47.94,18.41 IC7.5
IN29  (1 unrouted)
  Top 0.254: 58.42,20.64 C65.2 56.52,20.64 56.52,17.14 55.88,16.51 35.56,16.51 | 59.69,19.37 59.69,17.78 60.33,17.14 64.45,17.14 65.72,18.41 IC8.5
IN30  (via drill 0.3)
  Top 0.254: C55.2 40.01,18.41 v38.73,19.68 | v43.5,17.78 45.09,17.78 45.4,18.1 IC7.3
  Bottom 0.254: v38.73,19.68 41.59,19.68 v43.5,17.78
IN31  (via drill 0.3)
  Top 0.254: IC8.3 63.18,18.1 62.87,17.78 v61.28,17.78 | 57.78,18.29 C64.2 58.42,18.41 v58.42,17.14 57.15,15.88 35.56,15.88
  Bottom 0.254: v61.28,17.78 59.37,19.68 56.52,19.68 56.52,19.05 v58.42,17.14
N$1  (via drill 0.3)
  Top 0.254: IC1.2 44.13,58.74 44.45,59.05 v46.04,59.05
  Bottom 0.254: v46.04,59.05 45.09,59.05 44.98,58.95 C33.2 45.19,58.53 R2.1
N$2  (via drill 0.3)
  Top 0.254: IC1.1 42.86,58.1 v42.23,58.74
  Bottom 0.254: C33.1 v42.23,58.74 40.42,58.74 R1.1
N$3  (via drill 0.3)
  Top 0.254: IC1.7 50.48,58.1 v51.12,58.74
  Bottom 0.254: R3.1 51.97,58.74 v51.12,58.74 C34.1
N$4  (via drill 0.3)
  Top 0.254: IC1.8 50.48,61.91 v51.12,61.28
  Bottom 0.254: 52.49,61.38 R5.1 52.28,61.28 v51.12,61.28 C5.1
N$5  (via drill 0.3)
  Top 0.254: IC1.6 49.21,58.74 48.9,59.05 v47.31,59.05
  Bottom 0.254: R4.1 C34.2 48.05,59.05 v47.31,59.05
N$6  (via drill 0.3)
  Top 0.254: v42.23,61.28 42.86,61.91 IC1.14
  Bottom 0.254: C6.1 v42.23,61.28 40.32,61.28 R8.1
N$7  (via drill 0.3)
  Top 0.254: IC1.9 49.21,61.28 48.9,60.96 v47.31,60.96
  Bottom 0.254: R6.1 C5.2 48.68,60.96 v47.31,60.96
N$8  (via drill 0.3)
  Top 0.254: v46.04,60.96 44.45,60.96 44.13,61.28 IC1.13
  Bottom 0.254: C6.2 45.09,60.96 | 45.09,60.96 v46.04,60.96 | R7.1 45.19,61.06 45.09,60.96
N$9  (via drill 0.3)
  Top 0.254: IC3.1 42.86,45.4 v42.23,46.04
  Bottom 0.254: R17.1 41.06,46.04 v42.23,46.04 C21.1
N$10  (via drill 0.3)
  Top 0.254: IC3.2 44.13,46.04 44.45,46.35 v46.04,46.35
  Bottom 0.254: R18.1 44.87,43.5 44.77,43.5 44.98,43.71 C21.2 45.3,46.35 v46.04,46.35
N$11  (via drill 0.3)
  Top 0.254: IC2.1 60.64,58.1 v60.01,58.74
  Bottom 0.254: R9.1 58.2,58.74 v60.01,58.74 C12.1
N$12  (via drill 0.3)
  Top 0.254: IC2.2 61.91,58.74 62.23,59.05 v63.82,59.05
  Bottom 0.254: v63.82,59.05 63.08,59.05 C12.2 62.97,58.53 R10.1
N$13  (via drill 0.3)
  Top 0.254: IC2.7 68.26,58.1 v68.9,58.74
  Bottom 0.254: R11.1 69.75,58.74 v68.9,58.74 C13.1
N$14  (via drill 0.3)
  Top 0.254: IC2.6 66.99,58.74 66.67,59.05 v65.09,59.05
  Bottom 0.254: v65.09,59.05 65.83,59.05 C13.2 R12.1
N$15  (via drill 0.3)
  Top 0.254: IC2.8 68.26,61.91 v68.9,61.28
  Bottom 0.254: R13.1 69.75,61.28 v68.9,61.28 C14.1
N$16  (via drill 0.3)
  Top 0.254: IC2.14 60.64,61.91 v60.01,61.28
  Bottom 0.254: R16.1 58.2,61.28 v60.01,61.28 C15.1
N$17  (via drill 0.3)
  Top 0.254: IC2.9 66.99,61.28 66.67,60.96 v65.09,60.96
  Bottom 0.254: v65.09,60.96 65.83,60.96 C14.2 R14.1
N$18  (via drill 0.3)
  Top 0.254: IC2.13 61.91,61.28 62.23,60.96 v63.82,60.96
  Bottom 0.254: R15.1 62.76,63.3 C15.2 63.08,60.96 v63.82,60.96
N$19  (via drill 0.3)
  Top 0.254: IC3.7 50.48,45.4 v51.12,46.04
  Bottom 0.254: R19.1 51.97,46.04 v51.12,46.04 C22.1
N$20  (via drill 0.3)
  Top 0.254: IC3.6 49.21,46.04 48.9,46.35 v47.31,46.35
  Bottom 0.254: v47.31,46.35 48.05,46.35 C22.2 R20.1
N$21  (via drill 0.3)
  Top 0.254: IC3.8 50.48,49.21 v51.12,48.58
  Bottom 0.254: R21.1 51.97,48.58 v51.12,48.58 C23.1
N$22  (via drill 0.3)
  Top 0.254: IC3.14 42.86,49.21 v42.23,48.58
  Bottom 0.254: R24.1 41.06,48.58 v42.23,48.58 C24.1
N$23  (via drill 0.3)
  Top 0.254: IC3.9 49.21,48.58 48.9,48.26 v47.31,48.26
  Bottom 0.254: v47.31,48.26 48.05,48.26 C23.2 R22.1
N$24  (via drill 0.3)
  Top 0.254: IC3.13 44.13,48.58 44.45,48.26 v46.04,48.26
  Bottom 0.254: v46.04,48.26 45.3,48.26 C24.2 44.98,48.79 45.09,48.9 45.09,50.38 R23.1
N$25  (via drill 0.3)
  Top 0.254: IC5.1 60.64,45.4 v60.01,46.04
  Bottom 0.254: R25.1 58.84,46.04 v60.01,46.04 C31.1
N$26  (via drill 0.3)
  Top 0.254: IC5.2 61.91,46.04 62.23,46.35 v63.82,46.35
  Bottom 0.254: v63.82,46.35 63.08,46.35 C31.2 62.97,45.83 R26.1
N$27  (via drill 0.3)
  Top 0.254: IC5.7 68.26,45.4 v68.9,46.04
  Bottom 0.254: R27.1 69.75,46.04 v68.9,46.04 C32.1
N$28  (via drill 0.3)
  Top 0.254: IC5.6 66.99,46.04 66.67,46.35 v65.09,46.35
  Bottom 0.254: R28.1 C32.2 65.83,46.35 v65.09,46.35
N$29  (via drill 0.3)
  Top 0.254: IC5.8 68.26,49.31 v68.9,48.68
  Bottom 0.254: C35.1 67.94,48.68 v68.9,48.68 R29.1
N$30  (via drill 0.3)
  Top 0.254: IC5.14 60.64,49.21 v60.01,48.58
  Bottom 0.254: R32.1 58.84,48.58 v60.01,48.58 C36.1
N$31  (via drill 0.3)
  Top 0.254: IC5.9 66.99,48.58 66.67,48.26 v65.09,48.26
  Bottom 0.254: R30.1 C35.2 65.83,48.26 v65.09,48.26
N$32  (via drill 0.3)
  Top 0.254: IC5.13 61.91,48.58 62.23,48.26 v63.82,48.26
  Bottom 0.254: v63.82,48.26 63.08,48.26 C36.2 62.97,48.78 R31.1
N$33  (via drill 0.3)
  Top 0.254: IC4.1 42.86,32.7 v42.23,33.34
  Bottom 0.254: R33.1 41.06,33.34 v42.23,33.34 C41.1
N$34  (via drill 0.3)
  Top 0.254: IC4.2 44.13,33.34 44.45,33.66 v46.04,33.66
  Bottom 0.254: v46.04,33.66 45.3,33.66 C41.2 45.19,33.13 R34.1
N$35  (via drill 0.3)
  Top 0.254: IC4.7 50.48,32.7 v51.12,33.34
  Bottom 0.254: R35.1 51.97,33.34 v51.12,33.34 C42.1
N$36  (via drill 0.3)
  Top 0.254: IC4.6 49.21,33.34 48.9,33.66 v47.31,33.66
  Bottom 0.254: v47.31,33.66 48.05,33.66 C42.2 R36.1
N$37  (via drill 0.3)
  Top 0.254: IC4.8 50.48,36.51 v51.12,35.88
  Bottom 0.254: R37.1 51.97,35.88 v51.12,35.88 C43.1
N$38  (via drill 0.3)
  Top 0.254: IC4.14 42.86,36.51 v42.23,35.88
  Bottom 0.254: R40.1 41.06,35.88 v42.23,35.88 C44.1
N$39  (via drill 0.3)
  Top 0.254: IC4.9 49.21,35.88 48.9,35.56 v47.31,35.56
  Bottom 0.254: v47.31,35.56 48.05,35.56 C43.2 R38.1
N$40  (via drill 0.3)
  Top 0.254: IC4.13 44.13,35.88 44.45,35.56 v46.04,35.56
  Bottom 0.254: v46.04,35.56 45.3,35.56 C44.2 45.19,36.08 R39.1
N$41  (via drill 0.3)
  Top 0.254: IC6.1 60.64,32.7 v60.01,33.34
  Bottom 0.254: R41.1 58.84,33.34 v60.01,33.34 C50.1
N$42  (via drill 0.3)
  Top 0.254: IC6.2 61.91,33.34 62.23,33.66 v63.82,33.66
  Bottom 0.254: v63.82,33.66 63.08,33.66 C50.2 62.97,33.13 R42.1
N$43  (via drill 0.3)
  Top 0.254: IC6.7 68.26,32.7 v68.9,33.34
  Bottom 0.254: C51.1 v68.9,33.34 69.75,33.34 R43.1
N$44  (via drill 0.3)
  Top 0.254: IC6.6 66.99,33.34 66.67,33.66 v65.09,33.66
  Bottom 0.254: v65.09,33.66 65.83,33.66 C51.2 R44.1
N$45  (via drill 0.3)
  Top 0.254: IC6.8 68.26,36.51 v68.9,35.88
  Bottom 0.254: R45.1 69.75,35.88 v68.9,35.88 C52.1
N$46  (via drill 0.3)
  Top 0.254: IC6.14 60.64,36.51 v60.01,35.88
  Bottom 0.254: R48.1 58.84,35.88 v60.01,35.88 C53.1
N$47  (via drill 0.3)
  Top 0.254: IC6.9 66.99,35.88 66.67,35.56 v65.09,35.56
  Bottom 0.254: v65.09,35.56 65.83,35.56 C52.2 R46.1
N$48  (via drill 0.3)
  Top 0.254: IC6.13 61.91,35.88 62.23,35.56 v63.82,35.56
  Bottom 0.254: v63.82,35.56 63.08,35.56 C53.2 62.97,36.08 R47.1
N$49  (via drill 0.3)
  Top 0.254: IC7.1 42.86,20 v42.23,20.64
  Bottom 0.254: R49.1 41.06,20.64 v42.23,20.64 C59.1
N$50  (via drill 0.3)
  Top 0.254: IC7.2 44.13,20.64 44.45,20.95 v46.04,20.95
  Bottom 0.254: v46.04,20.95 45.3,20.95 C59.2 45.19,20.43 R50.1
N$51  (via drill 0.3)
  Top 0.254: IC7.7 50.48,20 v51.12,20.64
  Bottom 0.254: R51.1 51.97,20.64 v51.12,20.64 C60.1
N$52  (via drill 0.3)
  Top 0.254: IC7.6 49.21,20.64 48.9,20.95 v47.31,20.95
  Bottom 0.254: R52.1 C60.2 48.05,20.95 v47.31,20.95
N$53  (via drill 0.3)
  Top 0.254: IC7.8 50.48,23.81 v51.12,23.18
  Bottom 0.254: R53.1 51.97,23.18 v51.12,23.18 C61.1
N$54  (via drill 0.3)
  Top 0.254: IC7.14 42.86,23.81 v42.23,23.18
  Bottom 0.254: R56.1 41.06,23.18 v42.23,23.18 C62.1
N$55  (via drill 0.3)
  Top 0.254: IC7.9 49.21,23.18 48.9,22.86 v47.31,22.86
  Bottom 0.254: v47.31,22.86 48.05,22.86 C61.2 R54.1
N$56  (via drill 0.3)
  Top 0.254: IC7.13 44.13,23.18 44.45,22.86 v46.04,22.86
  Bottom 0.254: v46.04,22.86 45.3,22.86 C62.2 45.19,23.38 R55.1
N$57  (via drill 0.3)
  Top 0.254: IC8.1 60.64,20 v60.01,20.64
  Bottom 0.254: R57.1 58.84,20.64 v60.01,20.64 C68.1
N$58  (via drill 0.3)
  Top 0.254: IC8.2 61.91,20.64 62.23,20.95 v63.82,20.95
  Bottom 0.254: R58.1 62.97,20.43 C68.2 63.08,20.95 v63.82,20.95
N$59  (via drill 0.3)
  Top 0.254: IC8.7 68.26,20 v68.9,20.64
  Bottom 0.254: R59.1 69.75,20.64 v68.9,20.64 C69.1
N$60  (via drill 0.3)
  Top 0.254: IC8.6 66.99,20.64 66.67,20.95 v65.09,20.95
  Bottom 0.254: R60.1 C69.2 65.83,20.95 v65.09,20.95
N$61  (via drill 0.3)
  Top 0.254: IC8.8 68.26,23.81 v68.9,23.18
  Bottom 0.254: R61.1 69.75,23.18 v68.9,23.18 C70.1
N$62  (via drill 0.3)
  Top 0.254: IC8.14 60.64,23.81 v60.01,23.18
  Bottom 0.254: R64.1 58.84,23.18 v60.01,23.18 C71.1
N$63  (via drill 0.3)
  Top 0.254: IC8.9 66.99,23.18 66.67,22.86 v65.09,22.86
  Bottom 0.254: R62.1 C70.2 65.83,22.86 v65.09,22.86
N$64  (via drill 0.3)
  Top 0.254: IC8.13 61.91,23.18 62.23,22.86 v63.82,22.86
  Bottom 0.254: v63.82,22.86 63.08,22.86 C71.2 62.97,23.38 R63.1
OUT0
  Bottom 0.254: R8.2 41.17,63.08 42.86,64.77 46.99,64.77 | 46.99,64.77 52.39,64.77 53.34,63.82 55.56,63.82 57.78,66.04 70.8,66.04 73.66,63.18 SV1.1 | R7.2 46.89,64.67 46.99,64.77
OUT1
  Bottom 0.254: R6.2 50.48,63.08 R5.2 55.78,63.08 58.1,65.41 70.48,65.41 72.39,63.5 72.39,59.37 73.03,58.74 74.93,58.74 SV1.2
OUT2
  Bottom 0.254: R16.2 58.95,63.08 60.64,64.77 64.77,64.77 | 64.77,64.77 70.17,64.77 71.75,63.18 71.75,59.05 SV1.3 | R15.2 64.67,64.67 64.77,64.77
OUT3
  Bottom 0.254: R13.2 68.26,63.08 R14.2 | R13.2 69.85,63.18 | R13.2 69.85,62.87 71.12,62.87 71.12,58.1 73.03,56.2 74.93,56.2 SV1.4
OUT4
  Bottom 0.254: R12.2 68.26,56.94 R11.2 70.06,57.15 71.12,57.15 73.34,54.93 SV1.5
OUT5
  Bottom 0.254: R9.2 58.95,56.94 60.64,55.24 64.77,55.24 | 64.77,55.24 71.44,55.24 73.03,53.66 74.93,53.66 SV1.6 | R10.2 64.67,55.35 64.77,55.24
OUT6
  Bottom 0.254: R4.2 50.48,56.94 R3.2 55.78,56.94 58.1,54.61 71.12,54.61 73.34,52.39 SV1.7
OUT7
  Bottom 0.254: R1.2 41.17,56.94 42.86,55.24 46.99,55.24 | 46.99,55.24 52.39,55.24 53.34,56.2 55.56,56.2 57.78,53.98 70.17,53.98 73.03,51.12 74.93,51.12 SV1.8 | R2.2 46.89,55.35 46.99,55.24
OUT8
  Bottom 0.254: R24.2 41.17,50.38 42.86,52.07 46.99,52.07 | 46.99,52.07 52.39,52.07 53.34,51.12 55.56,51.12 57.78,53.34 69.85,53.34 73.34,49.85 SV1.9 | R23.2 46.89,51.97 46.99,52.07
OUT9
  Bottom 0.254: R22.2 50.48,50.38 R21.2 55.78,50.38 58.1,52.7 69.53,52.7 72.39,49.85 72.39,49.21 73.03,48.58 74.93,48.58 SV1.10
OUT10
  Bottom 0.254: R32.2 58.63,50.06 60.64,52.07 64.77,52.07 | 64.77,52.07 69.22,52.07 71.75,49.53 71.75,48.9 73.34,47.31 73.66,47.62 SV1.11 | 64.77,52.07 64.77,50.9 R31.2
OUT11
  Bottom 0.254: R30.2 68.26,50.38 R29.2 71.12,49.21 71.12,47.94 73.03,46.04 74.93,46.04 SV1.12
OUT12
  Bottom 0.254: R28.2 68.26,44.23 R27.2 70.38,44.77 SV1.13
OUT13
  Bottom 0.254: R25.2 58.95,44.23 60.64,42.55 64.77,42.55 | 64.77,42.55 72.07,42.55 73.03,43.5 74.93,43.5 SV1.14 | 64.77,42.55 64.77,43.71 R26.2
OUT14
  Bottom 0.254: R20.2 50.48,44.23 R19.2 55.78,44.23 58.1,41.91 73.03,41.91 73.34,42.23 SV1.15
OUT15
  Bottom 0.254: R17.2 41.17,44.23 42.86,42.55 46.99,42.55 | 46.99,42.55 52.39,42.55 53.34,43.5 55.56,43.5 57.78,41.27 72.71,41.27 73.03,40.96 74.93,40.96 SV1.16 | R18.2 46.89,42.65 46.99,42.55
OUT16
  Bottom 0.254: R40.2 41.17,37.68 42.86,39.37 46.99,39.37 | 46.99,39.37 52.39,39.37 53.34,38.42 55.56,38.42 57.78,40.64 72.71,40.64 SV1.17 | 46.99,39.37 46.99,38.2 R39.2
OUT17
  Bottom 0.254: R38.2 50.48,37.68 R37.2 55.78,37.68 58.1,40.01 71.44,40.01 73.03,38.42 74.93,38.42 SV1.18
OUT18
  Bottom 0.254: R48.2 58.74,37.78 60.33,39.37 64.77,39.37 | 64.77,39.37 71.12,39.37 73.34,37.15 SV1.19 | 64.77,39.37 64.77,38.2 R47.2
OUT19
  Bottom 0.254: R46.2 68.26,37.68 R45.2 71.22,37.68 73.03,35.88 74.93,35.88 SV1.20
OUT20
  Bottom 0.254: R44.2 68.26,31.54 R43.2 70.27,31.54 73.34,34.61 SV1.21
OUT21
  Bottom 0.254: R41.2 58.74,31.43 60.33,29.84 64.77,29.84 | 64.77,29.84 69.53,29.84 73.03,33.34 74.93,33.34 SV1.22 | R42.2 64.67,29.95 64.77,29.84
OUT22
  Bottom 0.254: R36.2 50.48,31.54 R35.2 55.78,31.54 58.1,29.21 69.85,29.21 72.71,32.07 SV1.23
OUT23
  Bottom 0.254: R33.2 41.17,31.54 42.86,29.84 46.99,29.84 | 46.99,29.84 52.39,29.84 53.34,30.8 55.56,30.8 57.78,28.57 70.17,28.57 72.39,30.8 74.93,30.8 SV1.24 | 46.99,29.84 46.99,31.01 R34.2
OUT24
  Bottom 0.254: R56.2 41.17,24.98 42.86,26.67 46.99,26.67 | 46.99,26.67 52.39,26.67 53.34,25.72 55.56,25.72 57.78,27.94 70.48,27.94 72.07,29.53 SV1.25 | 46.99,26.67 46.99,25.5 R55.2
OUT25
  Bottom 0.254: R54.2 50.48,24.98 R53.2 52.07,25.08 55.88,25.08 58.1,27.3 72.07,27.3 73.03,28.26 74.93,28.26 SV1.26
OUT26
  Bottom 0.254: R64.2 58.74,25.08 60.33,26.67 64.77,26.67 | 64.77,26.67 73.34,26.67 SV1.27 | 64.77,26.67 64.77,25.5 R63.2
OUT27
  Bottom 0.254: R62.2 68.26,24.98 R61.2 70.38,24.98 71.12,25.72 74.93,25.72 SV1.28
OUT28
  Bottom 0.254: R60.2 68.26,18.84 R59.2 70.27,18.84 71.12,19.68 71.12,23.5 72.07,24.45 SV1.29
OUT29
  Bottom 0.254: R57.2 58.74,18.73 60.33,17.14 64.77,17.14 | 64.77,17.14 70.17,17.14 71.75,18.73 71.75,21.91 73.03,23.18 74.93,23.18 SV1.30 | 64.77,17.14 64.77,18.31 R58.2
OUT30
  Bottom 0.254: R52.2 50.48,18.84 R51.2 55.78,18.84 58.1,16.51 70.48,16.51 72.39,18.41 72.39,20.95 73.34,21.91 SV1.31
OUT31
  Bottom 0.254: R49.2 41.17,18.84 42.86,17.14 46.99,17.14 | 46.99,17.14 52.39,17.14 53.34,18.1 55.56,18.1 57.78,15.88 70.8,15.88 73.03,18.1 74.93,18.1 74.93,20.64 SV1.32 | 46.99,17.14 46.99,18.31 R50.2

### Text on the board
Top: TODO: Hva med stående moduler / med 16 s&H + shift reg?